# Altium schematic sheet Sheet2.SchDoc
size A4; SheetNumber: 1; SheetTotal: 2
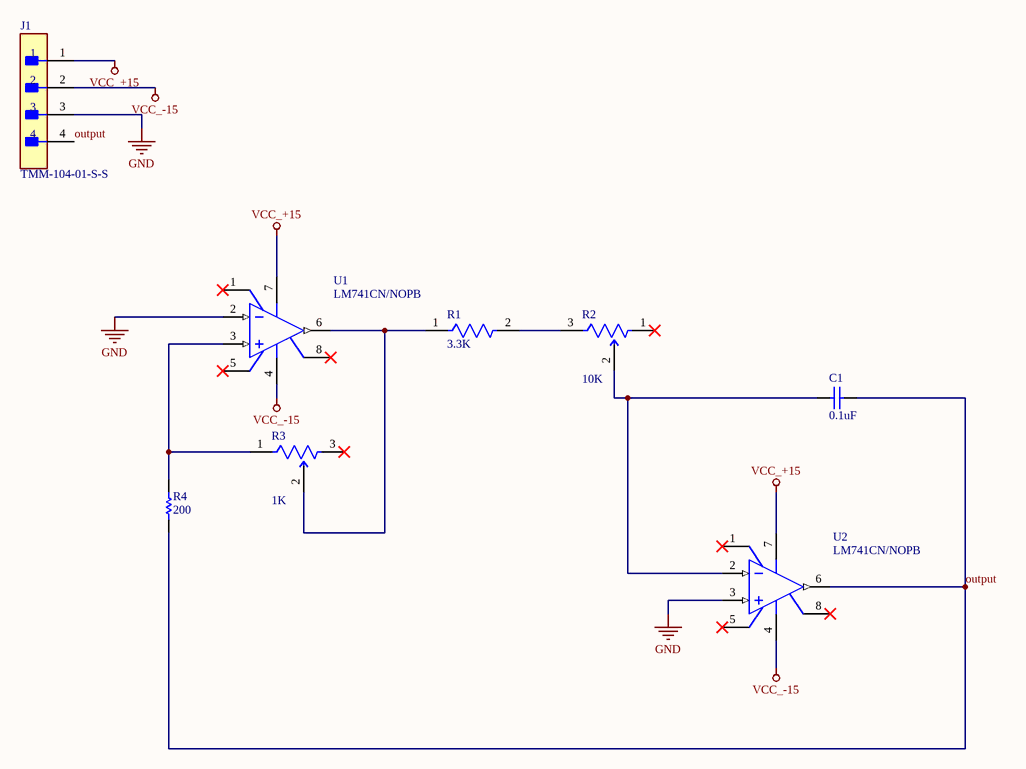
[diagram p0: Sheet2.SchDoc]

## Parts
C1  0.1uF  [CAPC2013X94X50LL20T25]
J1  TMM-104-01-S-S  [FP-TMM-104-01-S-S-MFG]
R1  3.3K  [FP-CRCW1206-e3-MFG]
R2  10K  [FP-3310R-MFG]
R3  1K  [FP-83A1A-B28-J10L-MFG]
R4  200  [RESC3216X70X40LL20T20]
U1  LM741CN/NOPB  [P0008A]
U2  LM741CN/NOPB  [P0008A]

## Nets
GND: J1.3 U1.2(IN-) U2.3(IN+)
VCC_+15: J1.1 U1.7(V+) U2.7(V+)
VCC_-15: J1.2 U1.4(V-) U2.4(V-)
output: C1.2 J1.4 R4.1 U2.6(OUT)
NetC1_1: C1.1 R2.2 U2.2(IN-)
NetR1_1: R1.1 R3.2(WIPER) U1.6(OUT)
NetR1_2: R1.2 R2.3(CW)
NetR3_1: R3.1(CCW) R4.2 U1.3(IN+)

Not connected (* = marked no-connect by the designer): R2 1(CCW)*; R3 3(CW)*; U1 1(OFS_NULL)* 5(OFS_NULL)* 8(NC)*; U2 1(OFS_NULL)* 5(OFS_NULL)* 8(NC)*

## Library data of the parts
C1 = CMP-2007-04175-1: Manufacturer: AVX Interconnect / Elco; Part Number: 08051C104KAZ2A
J1 = CMP-02766-001674-1: CONN HEADER VERT 4POS 2MM; Max Current Rating: 3.9A; Connector Type: Male Pin; Max Voltage Rating (AC): 500V; Number of Contacts: 4; Gender: Male; Color: Black; Packaging: Bulk; Orientation: Straight; Contact Mating Length: 0.126inch; Contact Plating: Gold; Max Operating Temperature: 125°C; Housing Color: Black; Contact Material: Bronze; Package Quantity: 1; Housing Material: Polymer; Radiation Hardening: No; Pitch: 2mm; Contact Type: Male Pin; Number of Positions: 4; Number of Rows: 1; Lead Free: Lead Free; Width: 1.97mm; Termination: Solder; Depth: 1.97mm; Series: FleXYZ™ TMM; RoHS Compliant: Yes; Length: 8mm; Min Operating Temperature: -55°C; Mount: Through Hole
R1 = CMP-2100-03617-2: RES Thick Film, 3.3kΩ, 1%, 0.25W, 100ppm/°C, 1206; Max Power Dissipation: 250mW; Voltage Rating (DC): 200V; Resistance: 3.3kR; Tolerance: 1%; Length: 3.2mm; Case Code (Metric): 3216; Contact Plating: Tin; Radiation Hardening: No; Lead Free: Lead Free; Max Operating Temperature: 155°C; Packaging: Tape and Reel; Power Rating: 250mW; Features: Automotive AEC-Q200; Weight: 0.000353oz; Temperature Coefficient: 100ppm/°C; Width: 1.6mm; Depth: 1.6mm; Number of Terminations: 2; Case Code (Imperial): 1206; Military Standard: Not; Height: 0.55mm; Composition: Thick Film; Min Operating Temperature: -55°C; Package Quantity: 10; Case/Package: 1206; Voltage Rating: 200V; Termination: SMD/SMT
R2 = CMP-07234-000023-1: POT 10K OHM 1/4W PLASTIC LINEAR; Resistance: 10kR; Max Power Dissipation: 250mW; Temperature Coefficient: 1000ppm/°C; Actuator Length: 0.22inch; Tolerance: 20%; Actuator Diameter: 0.125inch; Number of Turns: 1; Type: Potentiometer; Taper: Linear; Max Operating Temperature: 125°C; Package Quantity: 50; Packaging: Bulk; Composition: Conductive Plastic; REACH SVHC: No SVHC; Contact Plating: Tin; Number of Gangs: 1; Weight: 4.5g; Mount: Through Hole; Min Operating Temperature: -40°C; Termination: Pin; Power Rating: 250mW
R3 = CMP-07234-000027-1: POT 1K OHM 1W WIREWOUND LINEAR; Number of Gangs: 1; Voltage Rating (DC): 500V; Tolerance: 5%; Resistance: 1kR; Number of Turns: 10; Temperature Coefficient: 50ppm/°C; Actuator Diameter: 0.25inch; Linearity: 0.25%; Actuator Length: 0.875inch; Radiation Hardening: No; Packaging: Bulk; Resistor Type: Wirewound; RoHS Compliant: Yes; Package Quantity: 5; Military Standard: Not; Mount: Panel; Type: Potentiometer; Depth: 15.88mm; Height: 15.88mm; Termination: PCB; Min Operating Temperature: 1°C; Max Power Dissipation: 1W; Series: 83; Max Operating Temperature: 125°C; Length: 41.28mm; Power Rating: 1W; Taper: Linear
R4 = CMP-2003-04568-1: Manufacturer: KOA Speer; Part Number: RK73B2BTTD201J
U1 U2 = CMP-0055-00162-3: Operational Amplifier, 8-pin MDIP, Pb-Free; Manufacturer: Texas Instruments; PackageTopMarking: NSUZXYTTE#*LM*741CN; PowerWise: N; CompType: Amplifiers; ComponentLink1Description: Datasheet URL; ComponentLink1URL: http://www.ti.com/general/docs/lit/getliterature.tsp?genericPartNumber=LM741&fileType=pdf; PackageDescription: MDIP, .365 x .250 x .130in, 8 Lead, .100in Pitch; RoHS: Y; PinCount: 8; Code_JEDEC: MS-001-BA; Package Reference: P0008A